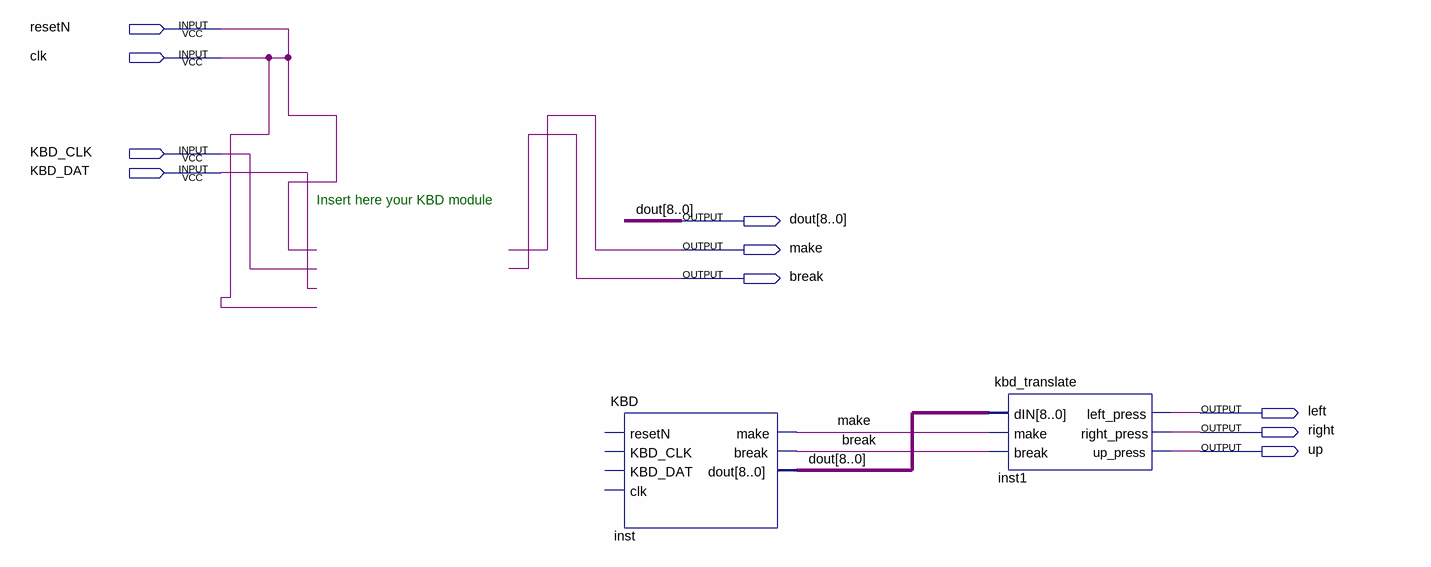
[diagram p0: schematic sheet]
// Quartus schematic key_Detector.bdf as structural Verilog: 2 symbols, 10 pins
module key_Detector (
  input  resetN,
  input  clk,
  input  KBD_CLK,
  input  KBD_DAT,
  output [8:0] dout,
  output make,
  output \break ,
  output left,
  output right,
  output up
);

  KBD inst (.make(make), .\break (\break ), .dout(dout));  // open: resetN, KBD_CLK, KBD_DAT, clk
  kbd_translate inst1 (
    .dIN(dout), .make(make), .\break (\break ), .left_press(left), .right_press(right), .up_press(up));

  assign resetN = clk;

  // Notes on the sheet:
  //   Insert here your KBD module
endmodule
